# EasyEDA Pro project ProPrj_chesslink-v1-pcb_2025-04-17.epro

# Schematic chesslink-v1_9
Board Name: april-9; Create Date: 2025-04-09; Page Name: P1; Project Name: chesslink-v1-pcb; Schematic Name: chesslink-v1_9; Update Date: 2025-04-09; Company: EasyEDA.com; Page Size: A4; Version: V1.0
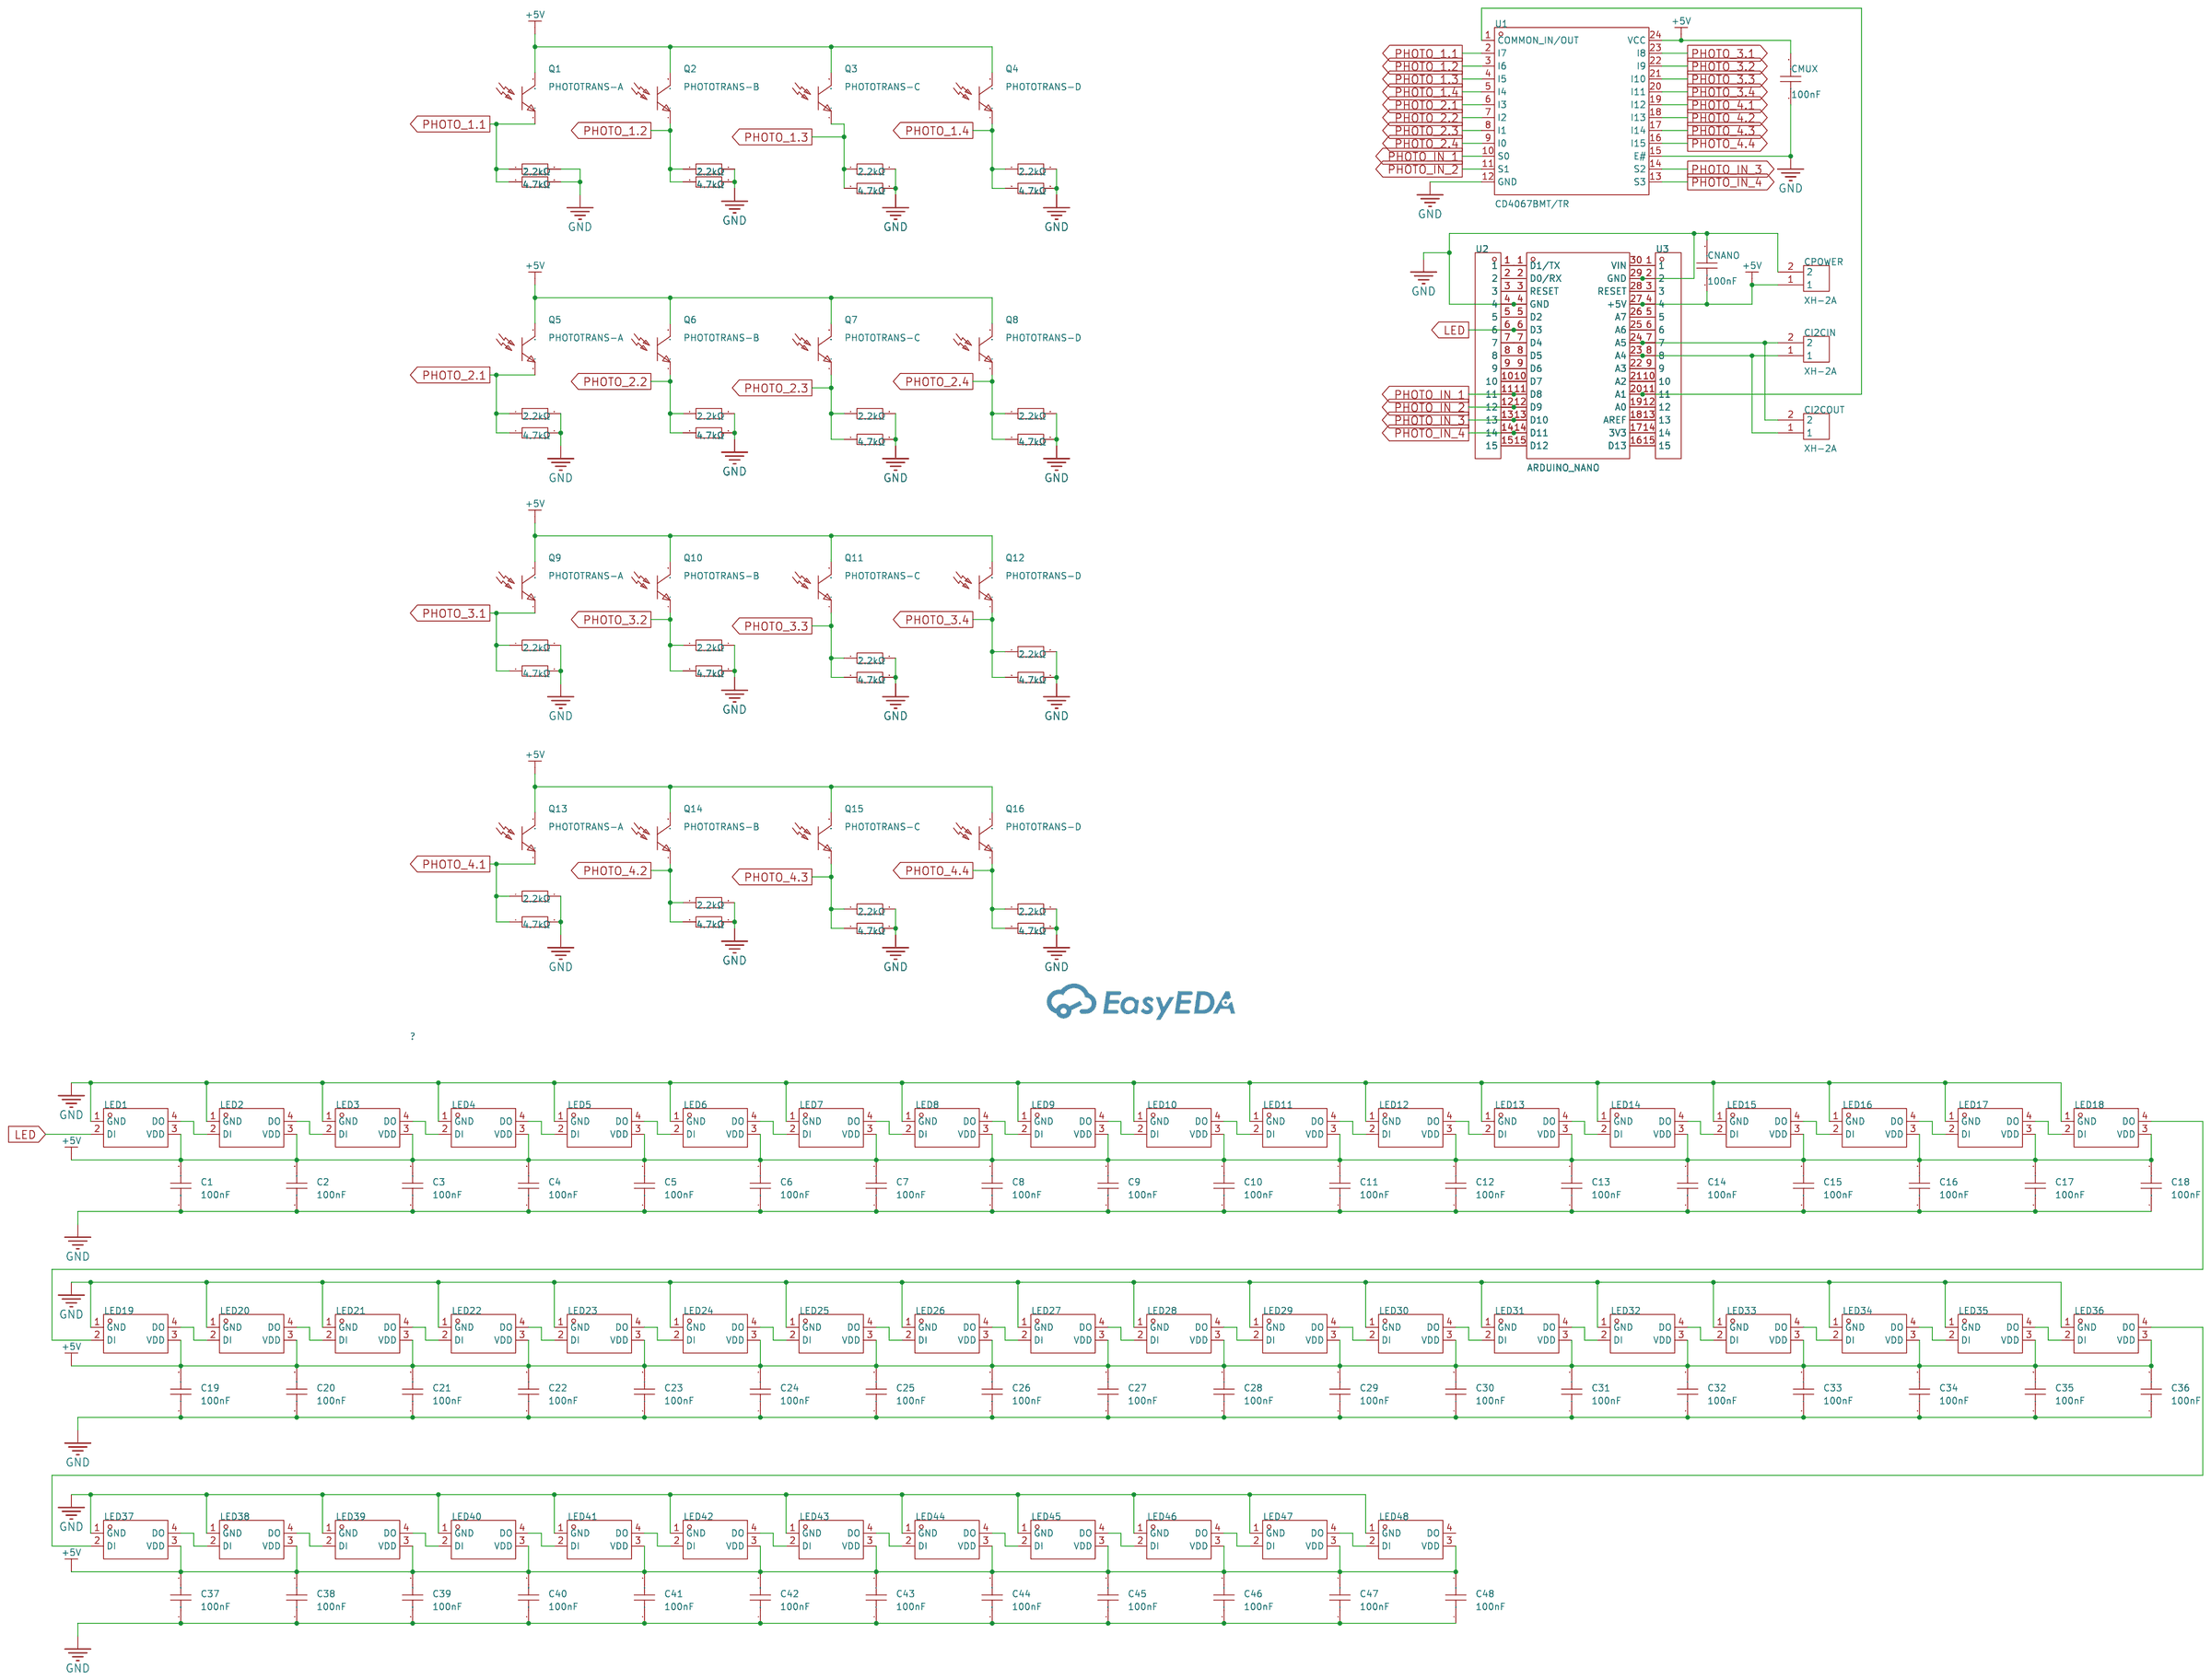
[diagram p0: schematic sheet]

## Parts
ArduinoNano  ARDUINO_NANO  [COMM-TH_ARDUINO_NANO]  (no BOM)
C1  100nF  [C0402]
C2  100nF  [C0402]
C3  100nF  [C0402]
C4  100nF  [C0402]
C5  100nF  [C0402]
C6  100nF  [C0402]
C7  100nF  [C0402]
C8  100nF  [C0402]
C9  100nF  [C0402]
C10  100nF  [C0402]
C11  100nF  [C0402]
C12  100nF  [C0402]
C13  100nF  [C0402]
C14  100nF  [C0402]
C15  100nF  [C0402]
C16  100nF  [C0402]
C17  100nF  [C0402]
C18  100nF  [C0402]
C19  100nF  [C0402]
C20  100nF  [C0402]
C21  100nF  [C0402]
C22  100nF  [C0402]
C23  100nF  [C0402]
C24  100nF  [C0402]
C25  100nF  [C0402]
C26  100nF  [C0402]
C27  100nF  [C0402]
C28  100nF  [C0402]
C29  100nF  [C0402]
C30  100nF  [C0402]
C31  100nF  [C0402]
C32  100nF  [C0402]
C33  100nF  [C0402]
C34  100nF  [C0402]
C35  100nF  [C0402]
C36  100nF  [C0402]
C37  100nF  [C0402]
C38  100nF  [C0402]
C39  100nF  [C0402]
C40  100nF  [C0402]
C41  100nF  [C0402]
C42  100nF  [C0402]
C43  100nF  [C0402]
C44  100nF  [C0402]
C45  100nF  [C0402]
C46  100nF  [C0402]
C47  100nF  [C0402]
C48  100nF  [C0402]
CI2CIN  XH-2A  [CONN-TH_XH-2A]  (no BOM)
CI2COUT  XH-2A  [CONN-TH_XH-2A]  (no BOM)
CMUX  100nF  [C0402]
CNANO  100nF  [C0402]
CPOWER  XH-2A  [CONN-TH_XH-2A]  (no BOM)
LED1  XL-1615RGBC-WS2812B  [LED-SMD_4P-L1.6-W1.5_XL-1615RGBC-WS2812B-1]
LED2  XL-1615RGBC-WS2812B  [LED-SMD_4P-L1.6-W1.5_XL-1615RGBC-WS2812B-1]
LED3  XL-1615RGBC-WS2812B  [LED-SMD_4P-L1.6-W1.5_XL-1615RGBC-WS2812B-1]
LED4  XL-1615RGBC-WS2812B  [LED-SMD_4P-L1.6-W1.5_XL-1615RGBC-WS2812B-1]
LED5  XL-1615RGBC-WS2812B  [LED-SMD_4P-L1.6-W1.5_XL-1615RGBC-WS2812B-1]
LED6  XL-1615RGBC-WS2812B  [LED-SMD_4P-L1.6-W1.5_XL-1615RGBC-WS2812B-1]
LED7  XL-1615RGBC-WS2812B  [LED-SMD_4P-L1.6-W1.5_XL-1615RGBC-WS2812B-1]
LED8  XL-1615RGBC-WS2812B  [LED-SMD_4P-L1.6-W1.5_XL-1615RGBC-WS2812B-1]
LED9  XL-1615RGBC-WS2812B  [LED-SMD_4P-L1.6-W1.5_XL-1615RGBC-WS2812B-1]
LED10  XL-1615RGBC-WS2812B  [LED-SMD_4P-L1.6-W1.5_XL-1615RGBC-WS2812B-1]
LED11  XL-1615RGBC-WS2812B  [LED-SMD_4P-L1.6-W1.5_XL-1615RGBC-WS2812B-1]
LED12  XL-1615RGBC-WS2812B  [LED-SMD_4P-L1.6-W1.5_XL-1615RGBC-WS2812B-1]
LED13  XL-1615RGBC-WS2812B  [LED-SMD_4P-L1.6-W1.5_XL-1615RGBC-WS2812B-1]
LED14  XL-1615RGBC-WS2812B  [LED-SMD_4P-L1.6-W1.5_XL-1615RGBC-WS2812B-1]
LED15  XL-1615RGBC-WS2812B  [LED-SMD_4P-L1.6-W1.5_XL-1615RGBC-WS2812B-1]
LED16  XL-1615RGBC-WS2812B  [LED-SMD_4P-L1.6-W1.5_XL-1615RGBC-WS2812B-1]
LED17  XL-1615RGBC-WS2812B  [LED-SMD_4P-L1.6-W1.5_XL-1615RGBC-WS2812B-1]
LED18  XL-1615RGBC-WS2812B  [LED-SMD_4P-L1.6-W1.5_XL-1615RGBC-WS2812B-1]
LED19  XL-1615RGBC-WS2812B  [LED-SMD_4P-L1.6-W1.5_XL-1615RGBC-WS2812B-1]
LED20  XL-1615RGBC-WS2812B  [LED-SMD_4P-L1.6-W1.5_XL-1615RGBC-WS2812B-1]
LED21  XL-1615RGBC-WS2812B  [LED-SMD_4P-L1.6-W1.5_XL-1615RGBC-WS2812B-1]
LED22  XL-1615RGBC-WS2812B  [LED-SMD_4P-L1.6-W1.5_XL-1615RGBC-WS2812B-1]
LED23  XL-1615RGBC-WS2812B  [LED-SMD_4P-L1.6-W1.5_XL-1615RGBC-WS2812B-1]
LED24  XL-1615RGBC-WS2812B  [LED-SMD_4P-L1.6-W1.5_XL-1615RGBC-WS2812B-1]
LED25  XL-1615RGBC-WS2812B  [LED-SMD_4P-L1.6-W1.5_XL-1615RGBC-WS2812B-1]
LED26  XL-1615RGBC-WS2812B  [LED-SMD_4P-L1.6-W1.5_XL-1615RGBC-WS2812B-1]
LED27  XL-1615RGBC-WS2812B  [LED-SMD_4P-L1.6-W1.5_XL-1615RGBC-WS2812B-1]
LED28  XL-1615RGBC-WS2812B  [LED-SMD_4P-L1.6-W1.5_XL-1615RGBC-WS2812B-1]
LED29  XL-1615RGBC-WS2812B  [LED-SMD_4P-L1.6-W1.5_XL-1615RGBC-WS2812B-1]
LED30  XL-1615RGBC-WS2812B  [LED-SMD_4P-L1.6-W1.5_XL-1615RGBC-WS2812B-1]
LED31  XL-1615RGBC-WS2812B  [LED-SMD_4P-L1.6-W1.5_XL-1615RGBC-WS2812B-1]
LED32  XL-1615RGBC-WS2812B  [LED-SMD_4P-L1.6-W1.5_XL-1615RGBC-WS2812B-1]
LED33  XL-1615RGBC-WS2812B  [LED-SMD_4P-L1.6-W1.5_XL-1615RGBC-WS2812B-1]
LED34  XL-1615RGBC-WS2812B  [LED-SMD_4P-L1.6-W1.5_XL-1615RGBC-WS2812B-1]
LED35  XL-1615RGBC-WS2812B  [LED-SMD_4P-L1.6-W1.5_XL-1615RGBC-WS2812B-1]
LED36  XL-1615RGBC-WS2812B  [LED-SMD_4P-L1.6-W1.5_XL-1615RGBC-WS2812B-1]
LED37  XL-1615RGBC-WS2812B  [LED-SMD_4P-L1.6-W1.5_XL-1615RGBC-WS2812B-1]
LED38  XL-1615RGBC-WS2812B  [LED-SMD_4P-L1.6-W1.5_XL-1615RGBC-WS2812B-1]
LED39  XL-1615RGBC-WS2812B  [LED-SMD_4P-L1.6-W1.5_XL-1615RGBC-WS2812B-1]
LED40  XL-1615RGBC-WS2812B  [LED-SMD_4P-L1.6-W1.5_XL-1615RGBC-WS2812B-1]
LED41  XL-1615RGBC-WS2812B  [LED-SMD_4P-L1.6-W1.5_XL-1615RGBC-WS2812B-1]
LED42  XL-1615RGBC-WS2812B  [LED-SMD_4P-L1.6-W1.5_XL-1615RGBC-WS2812B-1]
LED43  XL-1615RGBC-WS2812B  [LED-SMD_4P-L1.6-W1.5_XL-1615RGBC-WS2812B-1]
LED44  XL-1615RGBC-WS2812B  [LED-SMD_4P-L1.6-W1.5_XL-1615RGBC-WS2812B-1]
LED45  XL-1615RGBC-WS2812B  [LED-SMD_4P-L1.6-W1.5_XL-1615RGBC-WS2812B-1]
LED46  XL-1615RGBC-WS2812B  [LED-SMD_4P-L1.6-W1.5_XL-1615RGBC-WS2812B-1]
LED47  XL-1615RGBC-WS2812B  [LED-SMD_4P-L1.6-W1.5_XL-1615RGBC-WS2812B-1]
LED48  XL-1615RGBC-WS2812B  [LED-SMD_4P-L1.6-W1.5_XL-1615RGBC-WS2812B-1]
Q1  PHOTOTRANS-A  [OPTO-SMD_L2.0-W1.3-R-FD]
Q2  PHOTOTRANS-B  [OPTO-SMD_L2.0-W1.3-R-FD]
Q3  PHOTOTRANS-C  [OPTO-SMD_L2.0-W1.3-R-FD]
Q4  PHOTOTRANS-D  [OPTO-SMD_L2.0-W1.3-R-FD]
Q5  PHOTOTRANS-A  [OPTO-SMD_L2.0-W1.3-R-FD]
Q6  PHOTOTRANS-B  [OPTO-SMD_L2.0-W1.3-R-FD]
Q7  PHOTOTRANS-C  [OPTO-SMD_L2.0-W1.3-R-FD]
Q8  PHOTOTRANS-D  [OPTO-SMD_L2.0-W1.3-R-FD]
Q9  PHOTOTRANS-A  [OPTO-SMD_L2.0-W1.3-R-FD]
Q10  PHOTOTRANS-B  [OPTO-SMD_L2.0-W1.3-R-FD]
Q11  PHOTOTRANS-C  [OPTO-SMD_L2.0-W1.3-R-FD]
Q12  PHOTOTRANS-D  [OPTO-SMD_L2.0-W1.3-R-FD]
Q13  PHOTOTRANS-A  [OPTO-SMD_L2.0-W1.3-R-FD]
Q14  PHOTOTRANS-B  [OPTO-SMD_L2.0-W1.3-R-FD]
Q15  PHOTOTRANS-C  [OPTO-SMD_L2.0-W1.3-R-FD]
Q16  PHOTOTRANS-D  [OPTO-SMD_L2.0-W1.3-R-FD]
R1  4.7kΩ  [R0603]
R2  4.7kΩ  [R0603]
R3  4.7kΩ  [R0603]
R4  4.7kΩ  [R0603]
R5  4.7kΩ  [R0603]
R6  4.7kΩ  [R0603]
R7  4.7kΩ  [R0603]
R8  4.7kΩ  [R0603]
R9  4.7kΩ  [R0603]
R10  4.7kΩ  [R0603]
R11  4.7kΩ  [R0603]
R12  4.7kΩ  [R0603]
R13  4.7kΩ  [R0603]
R14  4.7kΩ  [R0603]
R15  4.7kΩ  [R0603]
R16  4.7kΩ  [R0603]
R22  2.2kΩ  [R0603]
R23  2.2kΩ  [R0603]
R24  2.2kΩ  [R0603]
R25  2.2kΩ  [R0603]
R26  2.2kΩ  [R0603]
R27  2.2kΩ  [R0603]
R28  2.2kΩ  [R0603]
R29  2.2kΩ  [R0603]
R30  2.2kΩ  [R0603]
R31  2.2kΩ  [R0603]
R32  2.2kΩ  [R0603]
R33  2.2kΩ  [R0603]
R34  2.2kΩ  [R0603]
R35  2.2kΩ  [R0603]
R36  2.2kΩ  [R0603]
R37  2.2kΩ  [R0603]
U1  CD4067BMT/TR  [TSSOP-24_L7.8-W4.4-P0.65-LS6.4-BL_1]
U2  KH-2.54FH-1X15P-H8.5  [HDR-TH_15P-P2.54-V-F]  (no BOM)
U3  KH-2.54FH-1X15P-H8.5  [HDR-TH_15P-P2.54-V-F]  (no BOM)

## Library data of the parts
ArduinoNano = ARDUINO_NANO: Supplier Part: C9900017879; Supplier Footprint: 插件; JLCPCB Part Class: Extended Part; Supplier: LCSC
C1-C48 CMUX CNANO = CL05B104KO5NNNC: Capacitance: Tolerance:±10% Tolerance:±10% Voltage Rated: Temperature Coefficient:; LCSC Part Name: 100nF ±10% 16V; Supplier Part: C1525; Manufacturer: SAMSUNG(三星); Supplier Footprint: 0402; JLCPCB Part Class: Basic Part; Datasheet: https://atta.szlcsc.com/upload/public/pdf/source/20160218/1457707763339.pdf; Supplier: LCSC; Tolerance: ±10%
CI2CIN CI2COUT CPOWER = XH-2A_C20079: Pins Structure:1x2P Pitch:2.5mm Mounting Type:Direct Insert Reference Series:XH Number of Pins:2P Number of Rows:1 Number of PINs Per Row:2 Row Spacing:- Current Rating:- Contact Material:- Contact Plating:- Operating Temperature:- Operating Temperature:-; LCSC Part Name: 1x2P 间距:2.5mm 直插 系列:XH; Supplier Part: C20079; Manufacturer: BOOMELE(博穆精密); Supplier Footprint: 插件,P=2.5mm; JLCPCB Part Class: Extended Part; Datasheet: https://atta.szlcsc.com/upload/public/pdf/source/20151225/1457707654857.pdf; Supplier: LCSC; Pins Structure: 1x2P; Pitch: 2.5mm; Mounting Type: Direct Insert; Reference Series: XH; Number of Pins: 2P; Number of Rows: 1; Number of PINs Per Row: 2
LED1-LED48 = XL-1615RGBC-WS2812B: Wavelength:620nm~625nm；525nm~530nm；465nm~470nm Luminous Intensity:360mcd；110mcd；130mcd Lens Color:Colorless Transparent Lens Installation method:Positive Stick Operating Temperature:-20℃~+85℃; LCSC Part Name: 幻彩透明 XL-1615RGBC-WS2812B; Supplier Part: C5349954; Manufacturer: XINGLIGHT(成兴光); Supplier Footprint: SMD-4P,1.6x1.5mm; JLCPCB Part Class: Extended Part; Datasheet: https://atta.szlcsc.com/upload/public/pdf/source/20250225/67A3F398505C98A70638B14BC571D0AB.pdf; Supplier: LCSC; Wavelength: 620nm~625nm；525nm~530nm；465nm~470nm; Luminous Intensity: 360mcd；110mcd；130mcd; Lens Color: Colorless Transparent Lens; Installation method: Positive Stick; Operating Temperature: -20℃~+85℃
Q1-Q16 = PT17-21C/L41/TR8: Transistor Type:NPN Collector Emitter Voltage:30V Collector Emitter Voltage:30V Collector Current (Ic):20mA Dissipation Power(Max):75mW Collector Dark Current:100nA Peak Wavelength:940nm Viewing Angle:- Operating Temperature:-25℃~+85℃ Operating Temperatur; LCSC Part Name: 940nm的NPN光电三极管; Supplier Part: C100090; Manufacturer: EVERLIGHT(亿光); Supplier Footprint: 0805; JLCPCB Part Class: Extended Part; Datasheet: https://atta.szlcsc.com/upload/public/pdf/source/20170412/1491985218480.pdf; Supplier: LCSC; Transistor Type: NPN; Collector Emitter Voltage: 30V; Collector Current (Ic): 20mA; Dissipation Power(Max): 75mW; Collector Dark Current: 100nA; Peak Wavelength: 940nm; Operating Temperature: -25℃~+85℃
R1-R16 = 0603WAF4701T5E: Type:Thick Film Resistors Resistance:4.7kΩ Tolerance:±1% Tolerance:±1% Power(Watts): Overload Voltage (Max): Temperature Coefficient:±100ppm/℃ Temperature Coefficient:±100ppm/℃ Operating Temperature Range:-55℃~+155℃ Operating Temperature Range:-55℃~+155℃; LCSC Part Name: 4.7kΩ ±1% 100mW 厚膜电阻; Supplier Part: C23162; Manufacturer: UNI-ROYAL(厚声); Supplier Footprint: 0603; JLCPCB Part Class: Basic Part; Datasheet: https://atta.szlcsc.com/upload/public/pdf/source/20200306/C422600_1E6D84923E4A46A82E41ADD87F860B5C.pdf; Supplier: LCSC; Type: Thick Film Resistors; Tolerance: ±1%; Temperature Coefficient: ±100ppm/℃; Operating Temperature Range: -55℃~+155℃
R22-R37 = 0603WAF2201T5E_C4190: Type:Thick Film Resistors Resistance:2.2kΩ Tolerance:±1% Tolerance:±1% Power(Watts): Overload Voltage (Max): Temperature Coefficient:±100ppm/℃ Temperature Coefficient:±100ppm/℃ Operating Temperature Range:-55℃~+155℃ Operating Temperature Range:-55℃~+155℃; LCSC Part Name: 2.2kΩ ±1% 100mW 厚膜电阻; Supplier Part: C4190; Manufacturer: UNI-ROYAL(厚声); Manufacturer Part: 0603WAF2201T5E; Supplier Footprint: 0603; JLCPCB Part Class: Basic Part; Datasheet: https://atta.szlcsc.com/upload/public/pdf/source/20200306/C422600_1E6D84923E4A46A82E41ADD87F860B5C.pdf; Supplier: LCSC; Type: Thick Film Resistors; Tolerance: ±1%; Temperature Coefficient: ±100ppm/℃; Operating Temperature Range: -55℃~+155℃
U1 = CD4067BMT/TR: Switch Circuit:Single Knife Sixteen Throw (SP16T) Number of Channels:16 Supply Voltage:3V~9V Supply Voltage:3V~9V On-State Resistance (Max):1300Ω Operating Temperature:-40℃~+105℃ Operating Temperature:-40℃~+105℃; LCSC Part Name: 16通道模拟多路复用器/多路分离器; Supplier Part: C7432333; Manufacturer: HGSEMI(华冠); Supplier Footprint: TSSOP-24; JLCPCB Part Class: Extended Part; Datasheet: https://atta.szlcsc.com/upload/public/pdf/source/20230815/971099B3440A45CE083B1C106516F24A.pdf; Supplier: LCSC; Switch Circuit: Single Knife Sixteen Throw (SP16T); Number of Channels: 16; Supply Voltage: 3V~9V; On-State Resistance (Max): 1300Ω; Operating Temperature: -40℃~+105℃
U2 U3 = KH-2.54FH-1X15P-H8.5: Holes Structure:1x15P Pitch:2.54mm Row Spacing:- Circular Hole / Square Hole:Square Holes Mounting Type:Straight Number of Rows:Plugin Number of Holes:15P Current Rating (Max):3A Voltage Rating (Max):- Holes Direction:Top Insulation Height:8.5mm Operating; LCSC Part Name: 间距:2.54mm 1x15P 直插; Supplier Part: C2932676; Manufacturer: kinghelm(金航标); Supplier Footprint: 插件,P=2.54mm; JLCPCB Part Class: Extended Part; Datasheet: https://atta.szlcsc.com/upload/public/pdf/source/20211220/977AA415CFA981E866620A80068F25CA.pdf; Supplier: LCSC; Holes Structure: 1x15P; Pitch: 2.54mm; Circular Hole / Square Hole: Square Holes; Mounting Type: Straight; Number of Rows: Plugin; Number of Holes: 15P; Current Rating (Max): 3A; Holes Direction: Top; Insulation Height: 8.5mm; Operating Temperature Range: -40℃~+105℃

## Nets
+5V: ArduinoNano.27(+5V) C1.2 C2.2 C3.2 C4.2 C5.2 C6.2 C7.2 C8.2 C9.2 C10.2 C11.2 C12.2 C13.2 C14.2 C15.2 C16.2 C17.2 C18.2 C19.2 C20.2 C21.2 C22.2 C23.2 C24.2 C25.2 C26.2 C27.2 C28.2 C29.2 C30.2 C31.2 C32.2 C33.2 C34.2 C35.2 C36.2 C37.2 C38.2 C39.2 C40.2 C41.2 C42.2 C43.2 C44.2 C45.2 C46.2 C47.2 C48.2 CMUX.2 CNANO.1 CPOWER.1 LED1.3(VDD) LED2.3(VDD) LED3.3(VDD) LED4.3(VDD) LED5.3(VDD) LED6.3(VDD) LED7.3(VDD) LED8.3(VDD) LED9.3(VDD) LED10.3(VDD) LED11.3(VDD) LED12.3(VDD) LED13.3(VDD) LED14.3(VDD) LED15.3(VDD) LED16.3(VDD) LED17.3(VDD) LED18.3(VDD) LED19.3(VDD) LED20.3(VDD) LED21.3(VDD) LED22.3(VDD) LED23.3(VDD) LED24.3(VDD) LED25.3(VDD) LED26.3(VDD) LED27.3(VDD) LED28.3(VDD) LED29.3(VDD) LED30.3(VDD) LED31.3(VDD) LED32.3(VDD) LED33.3(VDD) LED34.3(VDD) LED35.3(VDD) LED36.3(VDD) LED37.3(VDD) LED38.3(VDD) LED39.3(VDD) LED40.3(VDD) LED41.3(VDD) LED42.3(VDD) LED43.3(VDD) LED44.3(VDD) LED45.3(VDD) LED46.3(VDD) LED47.3(VDD) LED48.3(VDD) Q1.2(C) Q2.2(C) Q3.2(C) Q4.2(C) Q5.2(C) Q6.2(C) Q7.2(C) Q8.2(C) Q9.2(C) Q10.2(C) Q11.2(C) Q12.2(C) Q13.2(C) Q14.2(C) Q15.2(C) Q16.2(C) U1.24(VCC) U3.4
GND: ArduinoNano.4(GND) ArduinoNano.29(GND) C1.1 C2.1 C3.1 C4.1 C5.1 C6.1 C7.1 C8.1 C9.1 C10.1 C11.1 C12.1 C13.1 C14.1 C15.1 C16.1 C17.1 C18.1 C19.1 C20.1 C21.1 C22.1 C23.1 C24.1 C25.1 C26.1 C27.1 C28.1 C29.1 C30.1 C31.1 C32.1 C33.1 C34.1 C35.1 C36.1 C37.1 C38.1 C39.1 C40.1 C41.1 C42.1 C43.1 C44.1 C45.1 C46.1 C47.1 C48.1 CMUX.1 CNANO.2 CPOWER.2 LED1.1(GND) LED2.1(GND) LED3.1(GND) LED4.1(GND) LED5.1(GND) LED6.1(GND) LED7.1(GND) LED8.1(GND) LED9.1(GND) LED10.1(GND) LED11.1(GND) LED12.1(GND) LED13.1(GND) LED14.1(GND) LED15.1(GND) LED16.1(GND) LED17.1(GND) LED18.1(GND) LED19.1(GND) LED20.1(GND) LED21.1(GND) LED22.1(GND) LED23.1(GND) LED24.1(GND) LED25.1(GND) LED26.1(GND) LED27.1(GND) LED28.1(GND) LED29.1(GND) LED30.1(GND) LED31.1(GND) LED32.1(GND) LED33.1(GND) LED34.1(GND) LED35.1(GND) LED36.1(GND) LED37.1(GND) LED38.1(GND) LED39.1(GND) LED40.1(GND) LED41.1(GND) LED42.1(GND) LED43.1(GND) LED44.1(GND) LED45.1(GND) LED46.1(GND) LED47.1(GND) LED48.1(GND) R1.2 R2.2 R3.2 R4.2 R5.2 R6.2 R7.2 R8.2 R9.2 R10.2 R11.2 R12.2 R13.2 R14.2 R15.2 R16.2 R22.2 R23.2 R24.2 R25.2 R26.2 R27.2 R28.2 R29.2 R30.2 R31.2 R32.2 R33.2 R34.2 R35.2 R36.2 R37.2 U1.12(GND) U1.15(E#) U2.4 U3.2
LED: ArduinoNano.6(D3) LED1.2(DI) U2.6
PHOTO_1.1: Q1.1(E) R1.1 R22.1 U1.2(I7)
PHOTO_1.2: Q2.1(E) R2.1 R23.1 U1.3(I6)
PHOTO_1.3: Q3.1(E) R3.1 R24.1 U1.4(I5)
PHOTO_1.4: Q4.1(E) R4.1 R25.1 U1.5(I4)
PHOTO_2.1: Q5.1(E) R5.1 R26.1 U1.6(I3)
PHOTO_2.2: Q6.1(E) R6.1 R27.1 U1.7(I2)
PHOTO_2.3: Q7.1(E) R7.1 R28.1 U1.8(I1)
PHOTO_2.4: Q8.1(E) R8.1 R29.1 U1.9(I0)
PHOTO_3.1: Q9.1(E) R9.1 R30.1 U1.23(I8)
PHOTO_3.2: Q10.1(E) R10.1 R31.1 U1.22(I9)
PHOTO_3.3: Q11.1(E) R11.1 R32.1 U1.21(I10)
PHOTO_3.4: Q12.1(E) R12.1 R33.1 U1.20(I11)
PHOTO_4.1: Q13.1(E) R13.1 R34.1 U1.19(I12)
PHOTO_4.2: Q14.1(E) R14.1 R35.1 U1.18(I13)
PHOTO_4.3: Q15.1(E) R15.1 R36.1 U1.17(I14)
PHOTO_4.4: Q16.1(E) R16.1 R37.1 U1.16(I15)
PHOTO_IN_1: ArduinoNano.11(D8) U1.10(S0) U2.11
PHOTO_IN_2: ArduinoNano.12(D9) U1.11(S1) U2.12
PHOTO_IN_3: ArduinoNano.13(D10) U1.14(S2) U2.13
PHOTO_IN_4: ArduinoNano.14(D11) U1.13(S3) U2.14
Net-(ArduinoNano-1): ArduinoNano.1(D1/TX) U2.1
Net-(ArduinoNano-2): ArduinoNano.2(D0/RX) U2.2
Net-(ArduinoNano-3): ArduinoNano.3(RESET) U2.3
Net-(ArduinoNano-5): ArduinoNano.5(D2) U2.5
Net-(ArduinoNano-7): ArduinoNano.7(D4) U2.7
Net-(ArduinoNano-8): ArduinoNano.8(D5) U2.8
Net-(ArduinoNano-9): ArduinoNano.9(D6) U2.9
Net-(ArduinoNano-10): ArduinoNano.10(D7) U2.10
Net-(ArduinoNano-15): ArduinoNano.15(D12) U2.15
Net-(ArduinoNano-16): ArduinoNano.16(D13) U3.15
Net-(ArduinoNano-17): ArduinoNano.17(3V3) U3.14
Net-(ArduinoNano-18): ArduinoNano.18(AREF) U3.13
Net-(ArduinoNano-19): ArduinoNano.19(A0) U3.12
Net-(ArduinoNano-20): ArduinoNano.20(A1) U1.1(COMMON_IN/OUT) U3.11
Net-(ArduinoNano-21): ArduinoNano.21(A2) U3.10
Net-(ArduinoNano-22): ArduinoNano.22(A3) U3.9
Net-(ArduinoNano-23): ArduinoNano.23(A4) CI2CIN.1 CI2COUT.1 U3.8
Net-(ArduinoNano-24): ArduinoNano.24(A5) CI2CIN.2 CI2COUT.2 U3.7
Net-(ArduinoNano-25): ArduinoNano.25(A6) U3.6
Net-(ArduinoNano-26): ArduinoNano.26(A7) U3.5
Net-(ArduinoNano-28): ArduinoNano.28(RESET) U3.3
Net-(ArduinoNano-30): ArduinoNano.30(VIN) U3.1
Net-(LED1-4): LED1.4(DO) LED2.2(DI)
Net-(LED2-4): LED2.4(DO) LED3.2(DI)
Net-(LED3-4): LED3.4(DO) LED4.2(DI)
Net-(LED4-4): LED4.4(DO) LED5.2(DI)
Net-(LED5-4): LED5.4(DO) LED6.2(DI)
Net-(LED6-4): LED6.4(DO) LED7.2(DI)
Net-(LED7-4): LED7.4(DO) LED8.2(DI)
Net-(LED8-4): LED8.4(DO) LED9.2(DI)
Net-(LED9-4): LED9.4(DO) LED10.2(DI)
Net-(LED10-4): LED10.4(DO) LED11.2(DI)
Net-(LED11-4): LED11.4(DO) LED12.2(DI)
Net-(LED12-4): LED12.4(DO) LED13.2(DI)
Net-(LED13-4): LED13.4(DO) LED14.2(DI)
Net-(LED14-4): LED14.4(DO) LED15.2(DI)
Net-(LED15-4): LED15.4(DO) LED16.2(DI)
Net-(LED16-4): LED16.4(DO) LED17.2(DI)
Net-(LED17-4): LED17.4(DO) LED18.2(DI)
Net-(LED18-4): LED18.4(DO) LED19.2(DI)
Net-(LED19-4): LED19.4(DO) LED20.2(DI)
Net-(LED20-4): LED20.4(DO) LED21.2(DI)
Net-(LED21-4): LED21.4(DO) LED22.2(DI)
Net-(LED22-4): LED22.4(DO) LED23.2(DI)
Net-(LED23-4): LED23.4(DO) LED24.2(DI)
Net-(LED24-4): LED24.4(DO) LED25.2(DI)
Net-(LED25-4): LED25.4(DO) LED26.2(DI)
Net-(LED26-4): LED26.4(DO) LED27.2(DI)
Net-(LED27-4): LED27.4(DO) LED28.2(DI)
Net-(LED28-4): LED28.4(DO) LED29.2(DI)
Net-(LED29-4): LED29.4(DO) LED30.2(DI)
Net-(LED30-4): LED30.4(DO) LED31.2(DI)
Net-(LED31-4): LED31.4(DO) LED32.2(DI)
Net-(LED32-4): LED32.4(DO) LED33.2(DI)
Net-(LED33-4): LED33.4(DO) LED34.2(DI)
Net-(LED34-4): LED34.4(DO) LED35.2(DI)
Net-(LED35-4): LED35.4(DO) LED36.2(DI)
Net-(LED36-4): LED36.4(DO) LED37.2(DI)
Net-(LED37-4): LED37.4(DO) LED38.2(DI)
Net-(LED38-4): LED38.4(DO) LED39.2(DI)
Net-(LED39-4): LED39.4(DO) LED40.2(DI)
Net-(LED40-4): LED40.4(DO) LED41.2(DI)
Net-(LED41-4): LED41.4(DO) LED42.2(DI)
Net-(LED42-4): LED42.4(DO) LED43.2(DI)
Net-(LED43-4): LED43.4(DO) LED44.2(DI)
Net-(LED44-4): LED44.4(DO) LED45.2(DI)
Net-(LED45-4): LED45.4(DO) LED46.2(DI)
Net-(LED46-4): LED46.4(DO) LED47.2(DI)
Net-(LED47-4): LED47.4(DO) LED48.2(DI)

Not connected (* = marked no-connect by the designer): LED48 4(DO)
